# Altium schematic sheet FinalDesignCurrentMirror.SchDoc
size A4; SheetNumber: 1; SheetTotal: 1
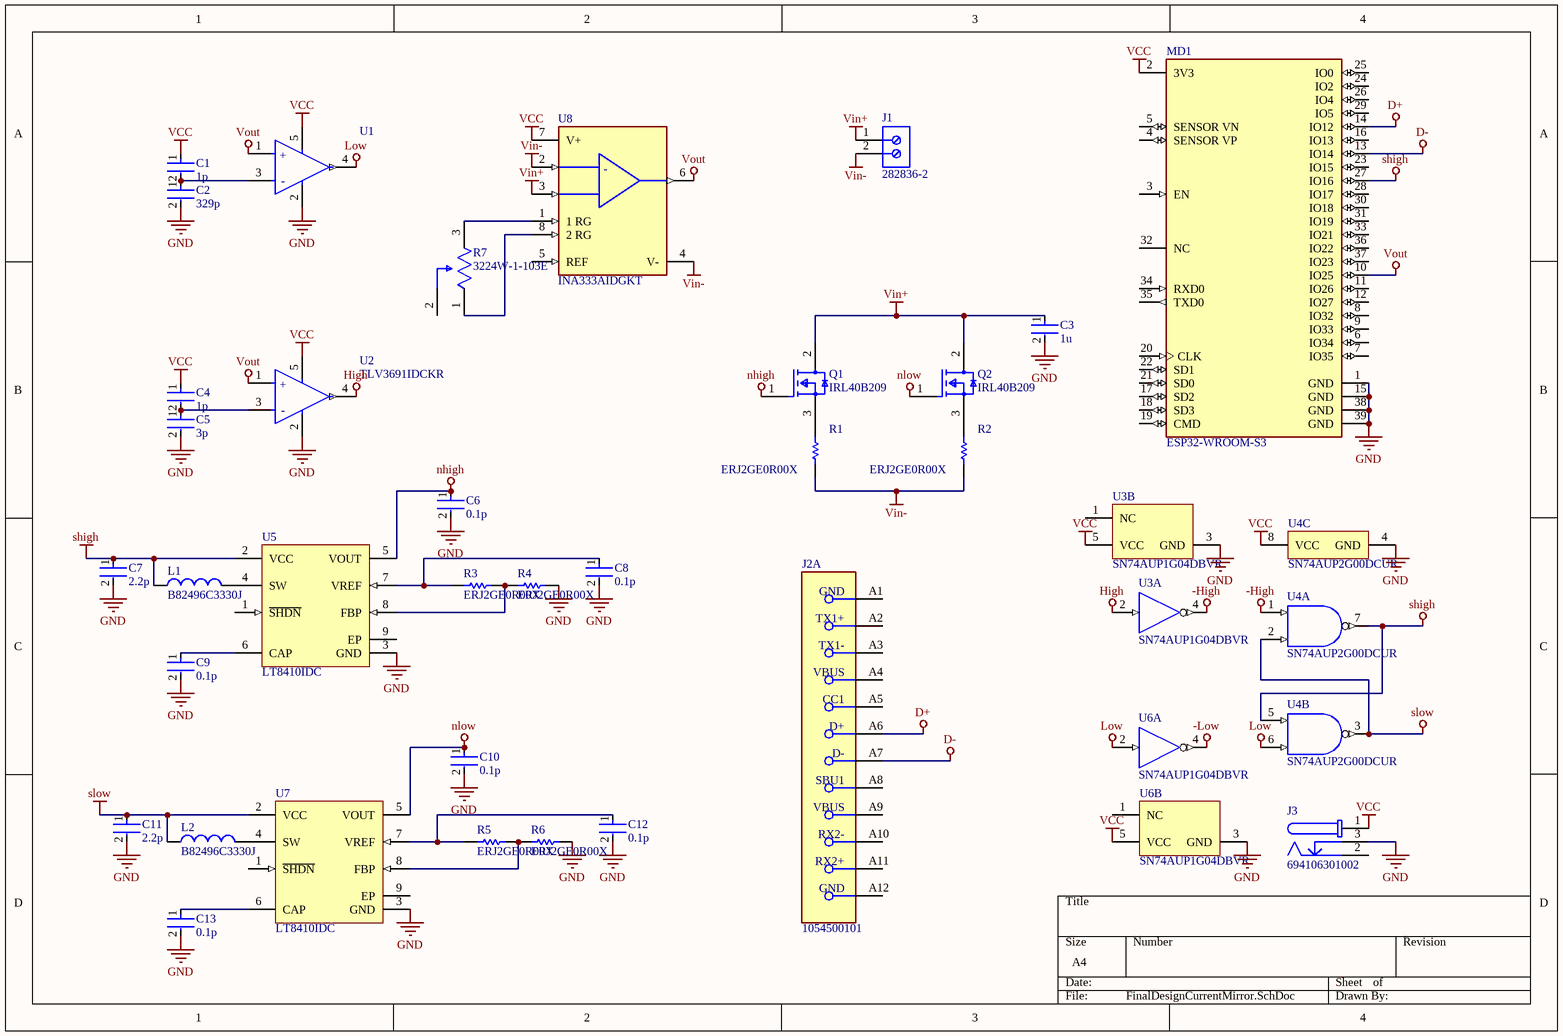
[diagram p0: FinalDesignCurrentMirror.SchDoc]

## Parts
C1  1p  [FP-GRM188-0_1-e0_2_0_55-IPC_A]
C2  329p  [FP-GRM188-0_1-e0_2_0_55-IPC_A]
C3  1u  [FP-GRM188-0_1-e0_2_0_55-IPC_A]
C4  1p  [FP-GRM188-0_1-e0_2_0_55-IPC_A]
C5  3p  [FP-GRM188-0_1-e0_2_0_55-IPC_A]
C6  0.1p  [FP-GRM188-0_1-e0_2_0_55-IPC_A]
C7  2.2p  [FP-GRM188-0_1-e0_2_0_55-IPC_A]
C8  0.1p  [FP-GRM188-0_1-e0_2_0_55-IPC_A]
C9  0.1p  [FP-GRM188-0_1-e0_2_0_55-IPC_A]
C10  0.1p  [FP-GRM188-0_1-e0_2_0_55-IPC_A]
C11  2.2p  [FP-GRM188-0_1-e0_2_0_55-IPC_A]
C12  0.1p  [FP-GRM188-0_1-e0_2_0_55-IPC_A]
C13  0.1p  [FP-GRM188-0_1-e0_2_0_55-IPC_A]
J1  282836-2  [TECO-282836-2_V]
J2  1054500101  [FP-1054500101-MFG]  (part A of 3)
J3  694106301002  [694106301002]
L1  B82496C3330J  [INDC1608X90X30LL10T20]
L2  B82496C3330J  [INDC1608X90X30LL10T20]
MD1  ESP32-WROOM-S3  [FP-ESP32-WROOM-32D-MFG]
Q1  IRL40B209  [FP-PG-TO220-3-MFG]
Q2  IRL40B209  [FP-PG-TO220-3-MFG]
R1  ERJ2GE0R00X  [RESC1005X40X25LL05T05]
R2  ERJ2GE0R00X  [RESC1005X40X25LL05T05]
R3  ERJ2GE0R00X  [RESC1005X40X25LL05T05]
R4  ERJ2GE0R00X  [RESC1005X40X25LL05T05]
R5  ERJ2GE0R00X  [RESC1005X40X25LL05T05]
R6  ERJ2GE0R00X  [RESC1005X40X25LL05T05]
R7  3224W-1-103E  [FP-3224W-MFG]
U1  (no value)  [FP-DCK0005A-IPC_A]
U2  TLV3691IDCKR  [FP-DCK0005A-IPC_A]
U3  SN74AUP1G04DBVR  [DBV0005A_L]  (parts A,B of 2)
U4  SN74AUP2G00DCUR  [DCU0008A_L]  (parts A,B,C of 3)
U5  LT8410IDC  [LT-DC8_V]
U6  SN74AUP1G04DBVR  [DBV0005A_L]  (parts A,B of 2)
U7  LT8410IDC  [LT-DC8_V]
U8  INA333AIDGKT  [FP-DGK0008A-MFG]

## Nets
-High: U3.4(Y) U4.1(1A)
-Low: U6.4(Y)
D+: J2.A6(D+) MD1.14(IO12)
D-: J2.A7(D-) MD1.13(IO14)
GND: C2.2 C3.2 C5.2 C6.2 C7.2 C8.2 C9.2 C10.2 C11.2 C12.2 C13.2 J3.3 MD1.1(GND) MD1.15(GND) MD1.38(GND) MD1.39(GND) R4.1 R6.1 U1.2(GND) U2.2(GND) U3.3(GND) U4.4(GND) U5.3(GND) U6.3(GND) U7.3(GND)
High: U2.4(OUT) U3.2(A)
Low: U1.4(OUT) U4.6(2B) U6.2(A)
nhigh: C6.1 Q1.1(G) U5.5(VOUT)
nlow: C10.1 Q2.1(G) U7.5(VOUT)
shigh: C7.1 L1.1 MD1.27(IO16) U4.5(2A) U4.7(1Y) U5.2(VCC)
slow: C11.1 L2.1 U4.2(1B) U4.3(2Y) U7.2(VCC)
VCC: C1.1 C4.1 J3.1 MD1.2(3V3) U1.5(VCC) U2.5(VCC) U3.5(VCC) U4.8(VCC) U6.5(VCC) U8.7(V+)
Vin+: C3.1 J1.1 Q1.2(D) Q2.2(D) U8.3(VIN+)
Vin-: J1.2 R1.1 R2.1 U8.2(VIN-) U8.4(V-)
Vout: MD1.10(IO25) U1.1(IN+) U2.1(IN+) U8.6(VOUT)
NetC1_2: C1.2 C2.1 U1.3(IN-)
NetC4_2: C4.2 C5.1 U2.3(IN-)
NetC8_1: C8.1 R3.2 U5.7(VREF)
NetC9_1: C9.1 U5.6(CAP)
NetC12_1: C12.1 R5.2 U7.7(VREF)
NetC13_1: C13.1 U7.6(CAP)
NetL1_2: L1.2 U5.4(SW)
NetL2_2: L2.2 U7.4(SW)
NetQ1_3: Q1.3(S) R1.2
NetQ2_3: Q2.3(S) R2.2
NetR3_1: R3.1 R4.2 U5.8(FBP)
NetR5_1: R5.1 R6.2 U7.8(FBP)
NetR7_1: R7.1(CCW) U8.8(2_RG)
NetR7_3: R7.3(CW) U8.1(1_RG)

Not connected (* = marked no-connect by the designer): J2 A1(GND) A2(TX1+) A3(TX1-) A4(VBUS) A5(CC1) A8(SBU1) A9(VBUS) A10(RX2-) A11(RX2+) A12(GND); J3 2; MD1 3(EN) 4(SENSOR_VP) 5(SENSOR_VN) 6(IO34) 7(IO35) 8(IO32) 9(IO33) 11(IO26) 12(IO27) 16(IO13) 17(SD2) 18(SD3) 19(CMD) 20(CLK) 21(SD0) 22(SD1) 23(IO15) 24(IO2) 25(IO0) 26(IO4) 28(IO17) 29(IO5) 30(IO18) 31(IO19) 32(NC) 33(IO21) 34(RXD0) 35(TXD0) 36(IO22) 37(IO23); R7 2(WIPER); U3 1(NC); U5 1(~{SHDN}) 9(EP); U6 1(NC); U7 1(~{SHDN}) 9(EP); U8 5(REF)

## Notes on the sheet
- (in symbol CMP-0944-00090-3) -
- (in symbol CMP-04896-000044-1) +; -

## Library data of the parts
C1-C13 = CMP-2006-02792-2: Chip Multilayer Ceramic Capacitors for General Purpose, 0603, 10uF, X5R, 15%, 20%, 6.3V; Packaging: Tape and Reel; Voltage Rating (DC): 6.3V; Width: 0.031inch; Termination: SMD/SMT; Dielectric: X5R; Package Quantity: 4000; Voltage Rating: 6.3V; Capacitance: 10uF; Case/Package: 0603; Min Operating Temperature: -55°C; Voltage: 6.3V; Length: 1.6mm; Thickness: 0.035inch; Lead Free: Lead Free; Depth: 0.8mm; Case Code (Imperial): 0603; Max Operating Temperature: 85°C; Material: Ceramic; Height: 0.8mm; Tolerance: 20%; Mount: Surface Mount; REACH SVHC: No SVHC; Radiation Hardening: No; Case Code (Metric): 1608
J1 = CMP-1684-00017-1: Female Header, Pitch 5 mm, 1 x 2 Position, Height 10 mm, Tail Length 3.5 mm, Rohs, Bulk; Manufacturer: TE Connectivity; Wire Gauge: 16-30AWG; Product Training Modules: Wire-to-BoardEurostyleTerminalBlocks; Clamp Material - Plating: Brass-NickelPlated; Voltage: 300V; Mating Orientation: HorizontalwithBoard; Current: 13.5A; Pitch: 0.197"(5.00mm); Screw Thread: M3; 3D Model: 282836-2.pdf; Other Names: 5ULV-02B / A98076; Dynamic Catalog: BuchananSeries; Number of Levels: 1; Torque - Screw: 0.68Nm(6Lb-In); Featured Product: EurostyleTerminalBlockConnectors; Positions Per Level: 2; Wire Termination: Screw-RisingCageClamp; Datasheet URL: http://www.te.com.cn/commerce/DocumentDelivery/DDEController?Action=showdoc&DocId=Catalog+Section%7F1308389_EUROSTYLE_TERMINAL_BLOCKS%7F0607%7Fpdf%7FEnglish%7FENG_CS_1308389_EUROSTYLE_TERMINAL_BLOCKS_0607.pdf%7F282836-2; Color: Green; Family: TerminalBlocks-WiretoBoard; RoHS Information: 282836-2StatementofCompliance; Standard Package: 300; Contact Material - Plating: Brass-TinPlated; Manufacturer URL: http://www.te.com; Housing Material: Polyamide(PA66),Nylon6/6; Features: Interlocking(Side); Package Description: Female Header, Pitch 5 mm, 1 x 2 Position, Height 10 mm, Tail Length 3.5 mm; Mounting Type: ThroughHole; Package Reference: THD; Packaging: Bulk; Series: Buchanan; Category: Connectors,Interconnects; Screw Material - Plating: Brass-NickelPlated
J2 = CMP-04767-000004-1: CONN RCP USB3.1 TYPEC 24P SMD RA; Manufacturer: Molex; Number Of Contacts: 24; Description: USB Shielded I/O Receptacle; Type C; Right Angle; Surface Mount; Gold over Nickel; Voltage Rating: 30V; Shielding: true; Is Female: yes; Current Rating: 0.25/1.25/5A; Pitch: 0.5mm; Conn Orientation: Right Angle; Package: 0; Height: 3.44mm; Footprint Url: https://www.molex.com/pdm_docs/sd/1054500101_sd.pdf; Device Class L1: Connectors; Category: Conn; Device Class L2: USB Connectors; Digikey Description: CONN RCP USB3.1 TYPEC 24P SMD RA; Contact Material: Gold,Nickel; Mouser Description: USB Shielded I/O Receptacle; Type C; Right Angle; Surface Mount; Gold over Nickel; ComponentLink2Description: Datasheet; Lead Free: Yes; Automotive: No; Temperature Range High: +85°C; RoHS: TRUE; Octopart: https://octopart.com/105450-0101-molex-68082325; ComponentLink2URL: https://www.molex.com/webdocs/datasheets/pdf/en-us/1054500101_IO_CONNECTORS.pdf; Temperature: -30°C to +85°C; Usb Standard: USB 3.1; Temperature Range Low: -30°C; Device Class L3: unset; Manufacturer Part Number: 1054500101
J3 = CMP-1502-00188-2: NexarPartId: 52676100; Voltage Rating (DC): 20V; Gender: Male; Voltage Rating: 24V; Connector Type: Power; Insulation Resistance: 100MΩ; Current Rating: 5A; Shielding: Unshielded; Number of Contacts: 3; Color: Black; Housing Material: Polyamide; Contact Gender: Female; REACH SVHC: Unknown; Termination: Through Hole; Height: 11mm; RoHS: Compliant; Mount: Through Hole; Flammability Rating: UL94 V-0; Packaging: Bulk; Min Operating Temperature: -40°C; Contact Plating: Tin; Max Operating Temperature: 85°C; Operating Supply Voltage: 24V; Contact Material: Gold, Tin
L1 L2 = CMP-2000-05913-1: Unshielded Wirewound Inductor, 33 nH, 350 mA, -55 to 150 degC, 0603 (1608 Metric), RoHS, Tape and Reel; Manufacturer: EPCOS-(TDK); Q @ Freq: 14@100MHz; Inductance: 33nH; Material - Core: Ceramic; Frequency - Self Resonant: 3GHz; DC Resistance (DCR): 600mOhmMax; Tolerance: ±5%; Frequency - Test: 100MHz; Current Rating: 350mA; Manufacturer URL: http://www.tdk.com/; Type: Wirewound; Mounting Type: SurfaceMount; Mounting Technology: SurfaceMount; Height - Seated (Max): 0.035"(0.90mm); Datasheet URL: https://en.tdk.eu/inf/30/db/ind_2008/b82496c.pdf; Shielding: Unshielded; Operating Temperature: -; Size / Dimension: 0.063"Lx0.031"W(1.60mmx0.80mm); Series: SIMID; Current - Saturation: -; Ratings: AEC-Q200; Packaging: CutTape(CT); Package Reference: 0603; Datasheet Version: 07/2016; Category: Inductors,Coils,Chokes; Package Description: 2-Pin Surface Mount Device, Body 1.6 x 0.8 mm; Family: FixedInductors; Package / Case: 0603(1608Metric)
MD1 = CMP-194065-000003-1: WIFI MODULE 32MBITS SPI FLASH; Manufacturer: Espressif Systems; Manufacturer Part Number: ESP32-WROOM-32D; Max Supply Voltage: 3.6V; Nominal Supply Current: 500mA; Max Frequency: 2484MHz; Number Of Adc Channels: 16; Number Of Gpio: 32; Interface: I2C,SPI,UART,Ethernet,I2S,Other; Data Rate: 150Mbits/s; Min Supply Voltage: 3V; Bandwidth: 72MHz; Sensitivity: -98dBm; Octopart: https://octopart.com/esp32-wroom-32d-espressif+systems-91040050; Package: ESP32-WROOM-32D; ComponentLink2URL: https://www.espressif.com/sites/default/files/documentation/esp32-wroom-32d_esp32-wroom-32u_datasheet_en.pdf; Lead Free: Yes; Category: UNK; Mouser Description: Wi-Fi/BT BLE Module ESP32-D0WD, SPI Flash, UART, P; Device Class L1: Integrated Circuits (ICs); RoHS: TRUE; Temperature Range Low: -40°C; ComponentLink2Description: Datasheet; Digikey Description: WIFI MODULE 32MBITS SPI FLASH; Height: 3.2mm; Temperature: -40°C to +85°C; Device Class L3: Transceivers; Device Class L2: RF Semiconductors and Devices; Temperature Range High: +85°C; Automotive: No
Q1 Q2 = CMP-32901-000691-1: MOSFET N-CH 40V 195A; Max Power Dissipation: 375W; Rds On Max: 1.25mR; Threshold Voltage: 2.4V; Input Capacitance: 15.14nF; Drain to Source Voltage (Vdss): 40V; Number of Pins: 3; Mount: Through Hole; Max Dual Supply Voltage: 40V; Series: HEXFET®, StrongIRFET™; Packaging: Rail/Tube; Halogen Free: Halogen Free; Lead Free: Lead Free; RoHS Compliant: Yes; Continuous Drain Current (ID): 195A; Max Operating Temperature: 175°C; Case/Package: TO-220; Min Operating Temperature: -55°C
R1-R6 = CMP-2000-07451-1: Chip Resistor, 0 Ohm, 0.1 W, -55 to 155 degC, 0402 (1005 Metric), RoHS, Tape and Reel; Manufacturer: Panasonic; Voltage Rating (DC): 50V; Temperature Coefficient: 600ppm/��C; Max Power Dissipation: 100mW; Resistance: 0mOhm; Tolerance: 5%; Number of Terminations: 2; Mount: SurfaceMount; Height: 0.35mm; Packaging: TapeandReel; Contact Plating: Tin; Manufacturer URL: http://www.panasonic.com/; Composition: ThickFilm; Max Operating Temperature: 155degC; REACH SVHC: NoSVHC; Case/Package: 0402; Package Reference: 402; Depth: 0.5mm; Package Description: 2-Pin Surface Mount Device, Body 1 x 0.5 mm; Datasheet URL: https://industrial.panasonic.com/cdbs/www-data/pdf/RDA0000/AOA0000C301.pdf; RoHSCompliant: True; Case Code (Imperial): 0402; Military Standard: Not; Min Operating Temperature: -55degC; Power Rating: 100mW; Datasheet Version: 03/2015; Length: 1mm; Case Code (Metric): 1005; Termination: SMD/SMT; Mounting Technology: SurfaceMount; Voltage Rating: 50V; Width: 0.02inch; Package Quantity: 1; Lead Free: LeadFree; Radiation Hardening: No
R7 = CMP-2000-05077-2: TRIMMER 10K OHM 0.25W J LEAD TOP; Manufacturer: Bourns; Tolerance: 10%; Resistance: 10kΩ; Temperature Coefficient: 100ppm/°C; Value: 10kΩ; Standoff Height: 0.2mm; Voltage Rating: 300V; Power Rating: 250mW; Device Class L3: Variable Resistors and Potentiometers; Composition: Cermet; Temperature Range Low: -65°C; Package: 3224W; ComponentLink2Description: Datasheet; Digikey Description: TRIMMER 10K OHM 0.25W J LEAD TOP; Category: Res; Mouser Description: Trimmer Resistors - SMD 4mm 10Kohms 10% Square Cermet Sealed; Temperature: -65°C to +150°C; Device Class L2: Resistors; Device Class L1: Passive Components; RoHS: TRUE; Temperature Range High: +150°C; Manufacturer Part Number: 3224W-1-103E; ComponentLink2URL: https://upverter.com/datasheet/a166fca85da25564670351d2dc712345c058bc40.pdf; Series: 3224; Height: 5.55mm; Lead Free: Yes; Octopart: https://octopart.com/3224w-1-103e-bourns-14818; Automotive: No
U1 U2 = CMP-04896-000044-1: IC COMPARATOR NANO-POWER SC70-5; Max Supply Voltage: 6.5V; Propagation Delay: 35us; Quiescent Current: 150nA; Max Input Current: 100pA; Min Supply Voltage: 900mV; Number of Elements: 1; Min Dual Supply Voltage: 450mV; Max Dual Supply Voltage: 3.25V; Output Current: 42mA; Input Offset Voltage (Vos): 3mV; Response Time: 24us; Packaging: Tape and Reel; Type: General Purpose; RoHS Compliant: Yes; Number of Pins: 5; Max Operating Temperature: 125°C; Input Bias Current: 100pA; Mount: Surface Mount; Radiation Hardening: No; Contact Plating: Gold; Number of Channels: 1; Min Operating Temperature: -40°C; Package Quantity: 3000; Lead Free: Lead Free; Case/Package: SC
U3 U6 = CMP-0859-00103-3: Low-Power Single Inverter Gate, DBV0005A, LARGE T&R; Manufacturer: Texas Instruments; Technology Family: AUP; Sub-Family: Inverting Buffer/Driver; 3-State Output: No; VCC(Max)(V): 3.6; Voltage(Nom)(V): 0.8,1.2,1.5,1.8,2.5,3.3; Bits(#): 1; Logic: Inverting; Output Drive (IOL/IOH)(Max)(mA): 20/-20; F @ Nom Voltage(Max)(Mhz): 100; VCC(Min)(V): 0.8; Input Type: CMOS; ICC @ Nom Voltage(Max)(mA): 0.0009; tpd @ Nom Voltage(Max)(ns): 25.4,16,10.8,9.2,6.5,5.4; Rating: Catalog; DatasheetVersion: SCES571K; Generic Part Number: SN74AUP1G04; Schmitt Trigger: No; Operating Temperature Range(C): -40 to 85; PackageReference: DBV0005A; Output Type: CMOS
U4 = CMP-0859-00590-3: Low-Power Dual 2-Input Positive-NAND Gate, DCU0008A, LARGE T&R; Manufacturer: Texas Instruments; tpd @ Nom Voltage(Max)(ns): 31.8,26.3,16.6,12.9,8.8,6.7; 3-State Output: No; Rating: Catalog; Output Type: CMOS; Bits(#): 2; ICC @ Nom Voltage(Max)(mA): 0.0009; Gate Type: NAND; F @ Nom Voltage(Max)(Mhz): 100; Output Drive (IOL/IOH)(Max)(mA): 20/-20; VCC(Min)(V): 0.8; Logic: True; VCC(Max)(V): 3.6; Technology Family: AUP; Voltage(Nom)(V): 0.8,1.2,1.5,1.8,2.5,3.3; Sub-Family: NAND Gate; Generic Part Number: SN74AUP2G00; PackageReference: DCU0008A; Schmitt Trigger: No; Input Type: CMOS; DatasheetVersion: SCES752C; Operating Temperature Range(C): -40 to 85
U5 U7 = CMP-0491-00021-1: Ultralow Power Boost Converter with Output Disconnect, 8-pin SON (DC8), -40 to 125 degC, Pb-Free, Mini Tape and Reel; PartNumber: LT8410IDC-1#TRMPBF; Manufacturer: Linear Technology; Number of Outputs: 1; ComponentLink2URL: http://cds.linear.com/docs/en/datasheet/84101fb.pdf; ComponentLink3Description: Package Specification; PackageReference: DC8; ComponentLink1URL: http://www.linear.com/; DatasheetVersion: Rev. B; ComponentLink1Description: Manufacturer URL; Mounting Technology: Surface Mount; Packing: Mini Tape and Reel; PackageDescription: 8-Pin Plastic DFN, Body 2 x 2 mm, Pitch 0.45 mm; RoHS: TRUE; ComponentLink2Description: Datasheet; ComponentLink3URL: http://cds.linear.com/docs/en/packaging/DFN_8_05-08-1719.pdf; PackageVersion: Rev. A, 04/2009
U8 = CMP-0944-00090-3: IC INST AMP 1 CIRCUIT 8VSSOP; Manufacturer: Texas Instruments; Min Dual Supply Voltage: 0.9V; Max Junction Temp: +150°C; Max Dual Supply Voltage: 2.75V; Input Bias Current: 0.00007uA; Standoff Height: 0.05mm; Nominal Supply Current: 50uA; Number Of Channels: 1; Voltage Gain: 0.001-1V/mV; Max Supply Voltage: 5.5V; Description: Instrumentation Amplifier 1 Circuit Rail-to-Rail 8-VSSOP; Import Ts: 1521844208; Input Offset Voltage: 0.010-0.025mV; Bandwidth: 150kHz; Min Supply Voltage: 1.8V; Ciiva Ids: 1154636; Device Class L1: Integrated Circuits (ICs); Temperature Range High: +125°C; Automotive: No; Ambient Temperature Range Low: -40°C; Height: 1.1mm; Mouser Description: Instrumentation Amplifiers Lo Pwr Prec Inst Amp; Release Date: 1464176905; Temperature: -40°C to +125°C; Device Class L2: Linear ICs; Temperature Range Low: -40°C; Octopart: https://octopart.com/ina333aidgkt-texas+instruments-8315938; ComponentLink2URL: http://www.ti.com/lit/ds/symlink/ina333.pdf; Lead Free: Yes; Category: IC; Package: DGK0008A; ComponentLink2Description: Datasheet; Digikey Description: IC INST AMP 1 CIRCUIT 8VSSOP; Manufacturer Part Number: INA333AIDGKT; Ambient Temperature Range High: +125°C; Device Class L3: Instrumentation; RoHS: TRUE